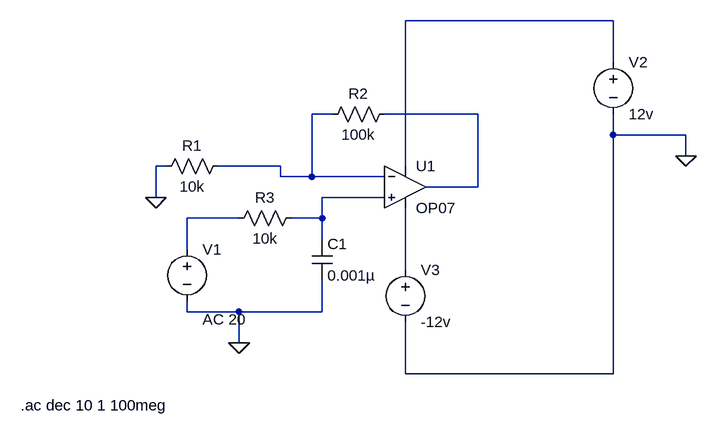
[diagram p0: schematic LowPassfilter.asc]
LowPassfilter.asc, the LTspice schematic file:
Version 4
SHEET 1 880 680
WIRE 528 -112 208 -112
WIRE 528 -48 528 -112
WIRE 96 32 64 32
WIRE 320 32 176 32
WIRE 528 64 528 32
WIRE 640 64 528 64
WIRE 640 96 640 64
WIRE -160 112 -176 112
WIRE 16 112 -80 112
WIRE 208 112 208 -112
WIRE 16 128 16 112
WIRE 64 128 64 32
WIRE 64 128 16 128
WIRE 176 128 64 128
WIRE 320 144 320 32
WIRE 320 144 240 144
WIRE -176 160 -176 112
WIRE 176 160 80 160
WIRE -48 192 -128 192
WIRE 80 192 80 160
WIRE 80 192 32 192
WIRE 80 224 80 192
WIRE -128 240 -128 192
WIRE 208 272 208 176
WIRE -128 336 -128 320
WIRE -48 336 -128 336
WIRE 80 336 80 288
WIRE 80 336 -48 336
WIRE -48 384 -48 336
WIRE 208 432 208 352
WIRE 528 432 528 64
WIRE 528 432 208 432
FLAG -48 384 0
FLAG -176 160 0
FLAG 640 96 0
SYMBOL OpAmps\\OP07 208 80 R0
SYMATTR InstName U1
SYMBOL res 192 16 R90
WINDOW 0 0 56 VBottom 2
WINDOW 3 32 56 VTop 2
SYMATTR InstName R2
SYMATTR Value 100k
SYMBOL voltage -128 224 R0
WINDOW 123 24 124 Left 2
WINDOW 39 0 0 Left 0
SYMATTR Value2 AC 20
SYMATTR InstName V1
SYMATTR Value ""
SYMBOL res -64 96 R90
WINDOW 0 0 56 VBottom 2
WINDOW 3 32 56 VTop 2
SYMATTR InstName R1
SYMATTR Value 10k
SYMBOL voltage 528 -64 R0
WINDOW 123 0 0 Left 0
WINDOW 39 0 0 Left 0
SYMATTR InstName V2
SYMATTR Value 12v
SYMBOL voltage 208 256 R0
WINDOW 123 0 0 Left 0
WINDOW 39 0 0 Left 0
SYMATTR InstName V3
SYMATTR Value -12v
SYMBOL res 48 176 R90
WINDOW 0 0 56 VBottom 2
WINDOW 3 32 56 VTop 2
SYMATTR InstName R3
SYMATTR Value 10k
SYMBOL cap 64 224 R0
SYMATTR InstName C1
SYMATTR Value 0.001µ
TEXT -384 480 Left 2 !.ac dec 10 1 100meg

The netlist it stands for:
* LowPassfilter.asc
XU1 N004 N002 N001 N006 N003 LT1001  ; OP07, pins In+ In- V+ V- OUT
R2 N003 N002 100k
V1 N005 0 AC 20
R1 N002 0 10k
V2 N001 0 12v
V3 N006 0 -12v
R3 N004 N005 10k
C1 N004 0 0.001µ
.ac dec 10 1 100meg
.lib LTC.lib
.backanno
.end